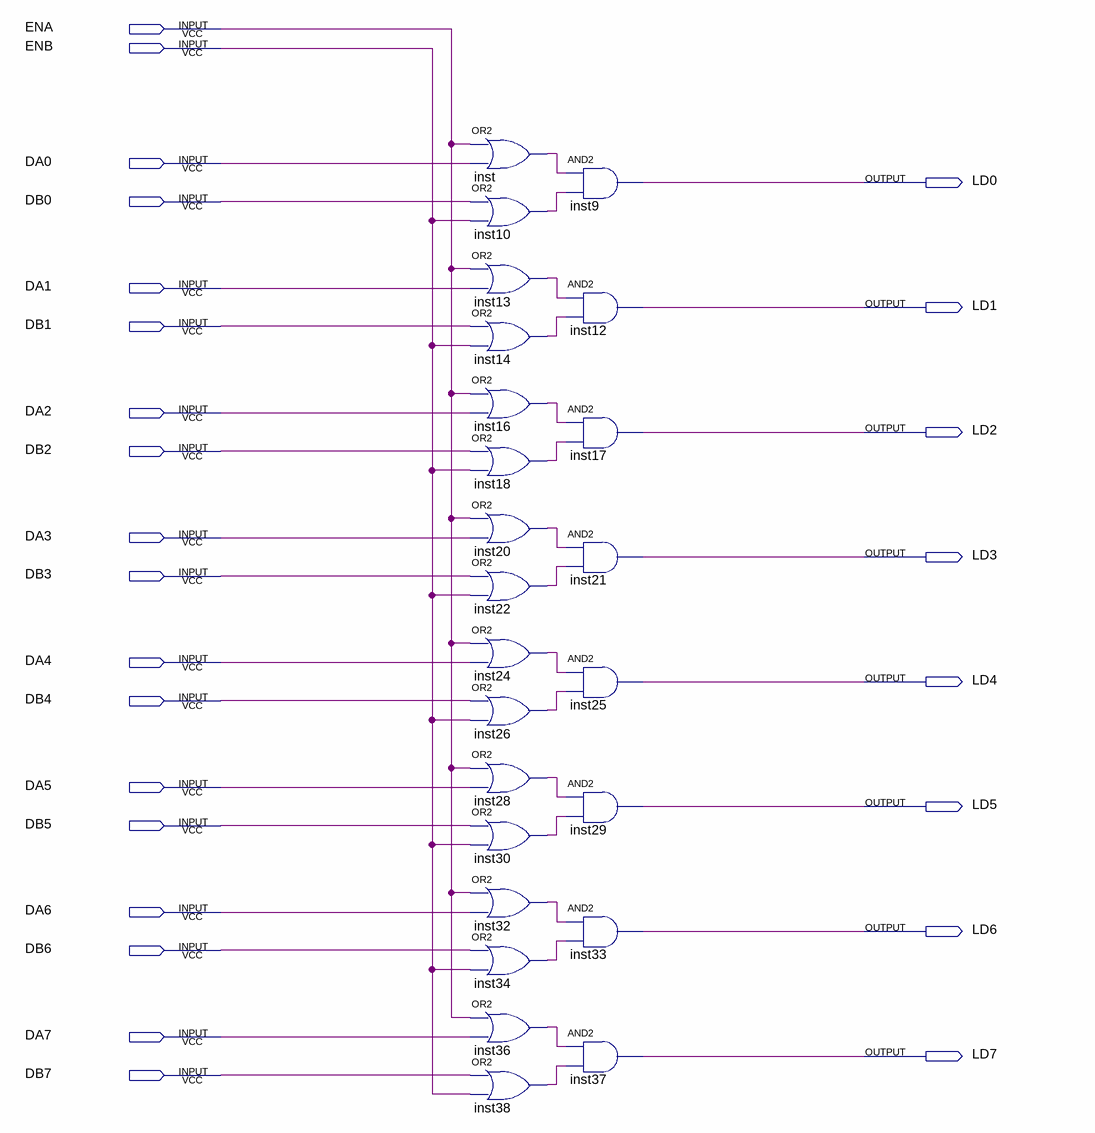
[diagram p0: schematic sheet]
// Quartus schematic 16bufer8__.bdf as structural Verilog: 24 symbols, 26 pins
module \16bufer8__  (
  input  ENA,
  input  ENB,
  input  DA0,
  input  DB0,
  input  DA1,
  input  DB1,
  input  DA2,
  input  DB2,
  input  DA3,
  input  DB3,
  input  DA4,
  input  DB4,
  input  DA5,
  input  DB5,
  input  DA6,
  input  DB6,
  input  DA7,
  input  DB7,
  output LD0,
  output LD1,
  output LD2,
  output LD3,
  output LD4,
  output LD5,
  output LD6,
  output LD7
);

  wire inst10_out, inst13_out, inst14_out, inst16_out, inst18_out, inst20_out, inst22_out, inst24_out,
       inst26_out, inst28_out, inst30_out, inst32_out, inst34_out, inst36_out, inst38_out, inst_out;

  or inst (inst_out, ENA, DA0);
  or inst10 (inst10_out, DB0, ENB);
  or inst13 (inst13_out, ENA, DA1);
  or inst14 (inst14_out, DB1, ENB);
  or inst16 (inst16_out, ENA, DA2);
  or inst18 (inst18_out, DB2, ENB);
  or inst20 (inst20_out, ENA, DA3);
  or inst22 (inst22_out, DB3, ENB);
  or inst24 (inst24_out, ENA, DA4);
  or inst26 (inst26_out, DB4, ENB);
  or inst28 (inst28_out, ENA, DA5);
  or inst30 (inst30_out, DB5, ENB);
  or inst32 (inst32_out, ENA, DA6);
  or inst34 (inst34_out, DB6, ENB);
  or inst36 (inst36_out, ENA, DA7);
  or inst38 (inst38_out, DB7, ENB);
  and inst9 (LD0, inst_out, inst10_out);
  and inst12 (LD1, inst13_out, inst14_out);
  and inst17 (LD2, inst16_out, inst18_out);
  and inst21 (LD3, inst20_out, inst22_out);
  and inst25 (LD4, inst24_out, inst26_out);
  and inst29 (LD5, inst28_out, inst30_out);
  and inst33 (LD6, inst32_out, inst34_out);
  and inst37 (LD7, inst36_out, inst38_out);
endmodule
